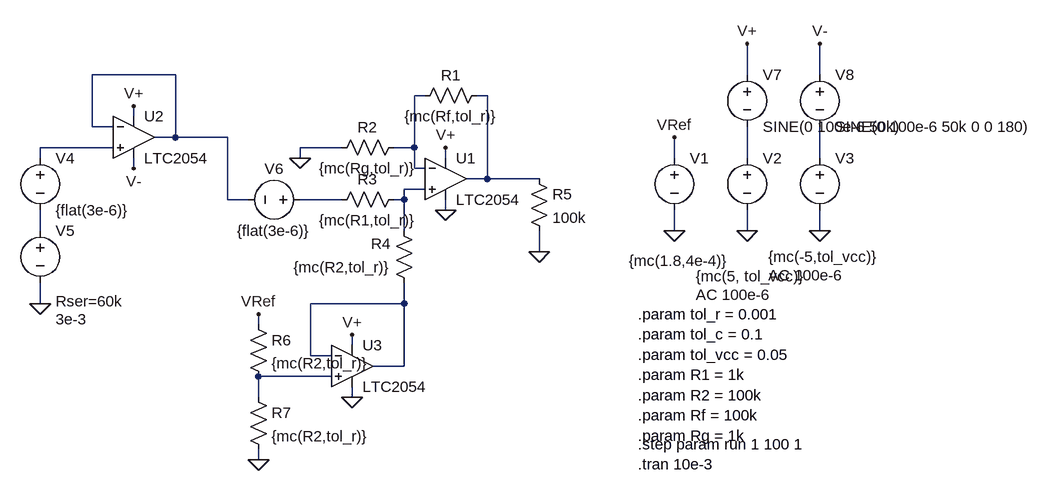
[diagram p0: schematic ThermopileAmp_Differential.asc]
ThermopileAmp_Differential.asc, the LTspice schematic file:
Version 4
SHEET 1 1108 680
WIRE -208 0 -336 0
WIRE 672 0 672 -48
WIRE 784 0 784 -48
WIRE 176 32 160 32
WIRE 272 32 256 32
WIRE -272 64 -272 48
WIRE -336 80 -336 0
WIRE -304 80 -336 80
WIRE -208 96 -208 0
WIRE -208 96 -240 96
WIRE -128 96 -208 96
WIRE -304 112 -416 112
WIRE 48 112 -16 112
WIRE 160 112 160 32
WIRE 160 112 128 112
WIRE -416 128 -416 112
WIRE -16 128 -16 112
WIRE 208 128 208 112
WIRE 560 128 560 96
WIRE 672 128 672 80
WIRE 784 128 784 80
WIRE -272 144 -272 128
WIRE 160 144 160 112
WIRE 176 144 160 144
WIRE 272 160 272 32
WIRE 272 160 240 160
WIRE 352 160 272 160
WIRE 176 176 144 176
WIRE -128 192 -128 96
WIRE -96 192 -128 192
WIRE 48 192 -16 192
WIRE 144 192 144 176
WIRE 144 192 128 192
WIRE 208 208 208 192
WIRE -416 240 -416 208
WIRE 144 240 144 192
WIRE 560 240 560 208
WIRE 672 240 672 208
WIRE 784 240 784 208
WIRE 352 272 352 240
WIRE -416 352 -416 320
WIRE 144 352 144 320
WIRE 144 352 0 352
WIRE -80 384 -80 368
WIRE 64 416 64 400
WIRE 0 432 0 352
WIRE 32 432 0 432
WIRE 144 448 144 352
WIRE 144 448 96 448
WIRE 32 464 -80 464
WIRE -80 496 -80 464
WIRE 64 496 64 480
WIRE -80 592 -80 576
FLAG 208 112 V+
FLAG 352 272 0
FLAG 560 240 0
FLAG 672 240 0
FLAG 784 240 0
FLAG 560 96 VRef
FLAG 672 -48 V+
FLAG 784 -48 V-
FLAG -16 128 0
FLAG -416 352 0
FLAG -272 144 V-
FLAG -272 48 V+
FLAG 64 400 V+
FLAG 64 496 0
FLAG -80 368 VRef
FLAG -80 592 0
FLAG 208 208 0
SYMBOL Opamps\\LTC2054 208 160 R0
SYMATTR InstName U1
SYMBOL res 272 16 R90
WINDOW 0 0 56 VBottom 2
WINDOW 3 32 56 VTop 2
SYMATTR InstName R1
SYMATTR Value {mc(Rf,tol_r)}
SYMBOL res 144 96 R90
WINDOW 0 0 56 VBottom 2
WINDOW 3 32 56 VTop 2
SYMATTR InstName R2
SYMATTR Value {mc(Rg,tol_r)}
SYMBOL res 144 176 R90
WINDOW 0 0 56 VBottom 2
WINDOW 3 32 56 VTop 2
SYMATTR InstName R3
SYMATTR Value {mc(R1,tol_r)}
SYMBOL res 160 336 R180
WINDOW 0 36 76 Left 2
WINDOW 3 36 40 Left 2
SYMATTR InstName R4
SYMATTR Value {mc(R2,tol_r)}
SYMBOL res 336 144 R0
SYMATTR InstName R5
SYMATTR Value 100k
SYMBOL voltage 560 112 R0
WINDOW 3 -70 174 Left 2
SYMATTR InstName V1
SYMATTR Value {mc(1.8,4e-4)}
SYMBOL voltage 672 112 R0
WINDOW 3 -79 198 Left 2
WINDOW 123 -79 226 Left 2
WINDOW 39 0 0 Left 2
SYMATTR InstName V2
SYMATTR Value {mc(5, tol_vcc)}
SYMATTR Value2 AC 100e-6
SYMBOL voltage 784 112 R0
WINDOW 3 -79 168 Left 2
WINDOW 123 -79 196 Left 2
WINDOW 39 0 0 Left 2
SYMATTR InstName V3
SYMATTR Value {mc(-5,tol_vcc)}
SYMATTR Value2 AC 100e-6
SYMBOL voltage -416 112 R0
SYMATTR InstName V4
SYMATTR Value {flat(3e-6)}
SYMBOL voltage -416 224 R0
WINDOW 3 24 152 Left 2
WINDOW 123 0 0 Left 2
WINDOW 39 24 124 Left 2
SYMATTR InstName V5
SYMATTR Value 3e-3
SYMATTR SpiceLine Rser=60k
SYMBOL Opamps\\LTC2054 -272 96 R0
SYMATTR InstName U2
SYMBOL voltage 0 192 R90
WINDOW 0 -32 56 VBottom 2
WINDOW 3 32 56 VTop 2
WINDOW 123 0 0 Left 2
WINDOW 39 0 0 Left 2
SYMATTR InstName V6
SYMATTR Value {flat(3e-6)}
SYMBOL voltage 672 -16 R0
WINDOW 123 0 0 Left 2
WINDOW 39 0 0 Left 2
SYMATTR InstName V7
SYMATTR Value SINE(0 100e-6 50k)
SYMBOL voltage 784 -16 R0
WINDOW 123 0 0 Left 2
WINDOW 39 0 0 Left 2
SYMATTR InstName V8
SYMATTR Value SINE(0 100e-6 50k 0 0 180)
SYMBOL Opamps\\LTC2054 64 448 R0
SYMATTR InstName U3
SYMBOL res -96 368 R0
SYMATTR InstName R6
SYMATTR Value {mc(R2,tol_r)}
SYMBOL res -96 480 R0
SYMATTR InstName R7
SYMATTR Value {mc(R2,tol_r)}
TEXT 504 368 Left 2 !.param tol_r = 0.001\n.param tol_c = 0.1\n.param tol_vcc = 0.05\n.param R1 = 1k\n.param R2 = 100k\n.param Rf = 100k\n.param Rg = 1k
TEXT 504 568 Left 2 !.step param run 1 100 1\n.tran 10e-3

The netlist it stands for:
* ThermopileAmp_Differential.asc
XU1 N007 N002 N003 V+ 0 LTC2054  ; pins In+ In- OUT V+ V-
R1 N003 N002 {mc(Rf,tol_r)}
R2 N002 0 {mc(Rg,tol_r)}
R3 N007 N008 {mc(R1,tol_r)}
R4 N010 N007 {mc(R2,tol_r)}
R5 N003 0 100k
V1 VRef 0 {mc(1.8,4e-4)}
V2 N005 0 {mc(5, tol_vcc)} AC 100e-6
V3 N006 0 {mc(-5,tol_vcc)} AC 100e-6
V4 N004 N009 {flat(3e-6)}
V5 N009 0 3e-3 Rser=60k
XU2 N004 N001 N001 V+ V- LTC2054  ; pins In+ In- OUT V+ V-
V6 N008 N001 {flat(3e-6)}
V7 V+ N005 SINE(0 100e-6 50k)
V8 V- N006 SINE(0 100e-6 50k 0 0 180)
XU3 N011 N010 N010 V+ 0 LTC2054  ; pins In+ In- OUT V+ V-
R6 VRef N011 {mc(R2,tol_r)}
R7 N011 0 {mc(R2,tol_r)}
.param tol_r = 0.001
.param tol_c = 0.1
.param tol_vcc = 0.05
.param R1 = 1k
.param R2 = 100k
.param Rf = 100k
.param Rg = 1k
.step param run 1 100 1
.tran 10e-3
.lib LTC2.lib
.backanno
.end